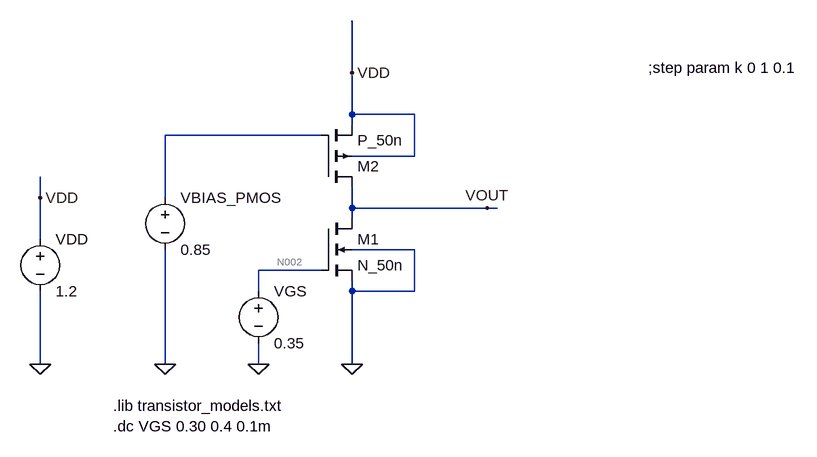
[diagram p0: schematic lab07_cs_amp_w_cs.asc]
lab07_cs_amp_w_cs.asc, the LTspice schematic file:
Version 4
SHEET 1 880 680
WIRE 160 -176 160 -256
WIRE 160 -112 160 -176
WIRE 256 -112 160 -112
WIRE 160 -96 160 -112
WIRE 112 -80 -128 -80
WIRE 256 -48 256 -112
WIRE 256 -48 160 -48
WIRE -320 16 -320 -16
WIRE -128 16 -128 -80
WIRE 160 32 160 0
WIRE 368 32 160 32
WIRE 384 32 368 32
WIRE 160 48 160 32
WIRE -320 80 -320 16
WIRE 256 96 160 96
WIRE 112 128 16 128
WIRE 16 160 16 128
WIRE 160 160 160 144
WIRE 256 160 256 96
WIRE 256 160 160 160
WIRE -320 272 -320 160
WIRE -128 272 -128 96
WIRE 16 272 16 240
WIRE 160 272 160 160
FLAG 160 272 0
FLAG 16 272 0
FLAG -320 272 0
FLAG -320 16 VDD
FLAG 368 32 VOUT
FLAG 160 -176 VDD
FLAG -128 272 0
SYMBOL nmos4 112 48 R0
SYMATTR InstName M1
SYMATTR Value2 l=2u w=62.5u
SYMATTR Value N_50n
SYMBOL voltage 16 144 R0
WINDOW 123 0 0 Left 0
WINDOW 39 0 0 Left 0
SYMATTR InstName VGS
SYMATTR Value 0.35
SYMBOL voltage -320 64 R0
WINDOW 123 0 0 Left 0
WINDOW 39 0 0 Left 0
SYMATTR InstName VDD
SYMATTR Value 1.2
SYMBOL pmos4 112 0 M180
SYMATTR InstName M2
SYMATTR Value2 l=2u w=203.4u
SYMATTR Value P_50n
SYMBOL voltage -128 0 R0
WINDOW 123 0 0 Left 0
WINDOW 39 0 0 Left 0
SYMATTR InstName VBIAS_PMOS
SYMATTR Value 0.85
TEXT -208 336 Left 2 !.lib transistor_models.txt
TEXT -208 368 Left 2 !.dc VGS 0.30 0.4 0.1m
TEXT 616 -184 Left 2 !;step param k 0 1 0.1

The netlist it stands for:
* lab07_cs_amp_w_cs.asc
M1 VOUT N002 0 0 N_50n l=2u w=62.5u
VGS N002 0 0.35
VDD VDD 0 1.2
M2 VOUT N001 VDD VDD P_50n l=2u w=203.4u
VBIAS_PMOS N001 0 0.85
.model NMOS NMOS
.model PMOS PMOS
.lib standard.mos
.lib transistor_models.txt
.dc VGS 0.30 0.4 0.1m
;step param k 0 1 0.1
.backanno
.end

* Results of the author's LTspice run, read from the files saved beside the schematic
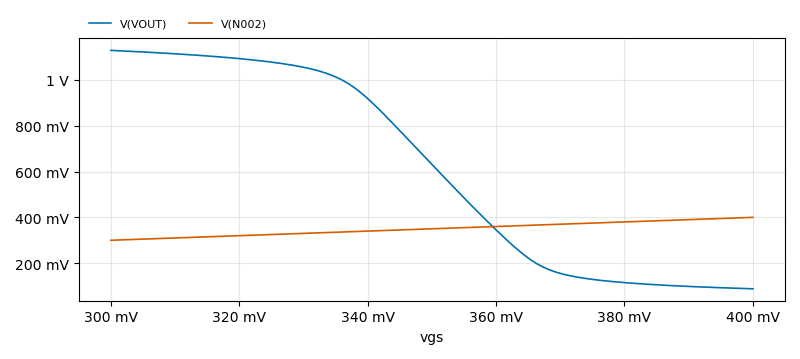
[diagram p1: DC transfer characteristic of lab07_cs_amp_w_cs.asc, plotted from the saved traces]
* DC transfer characteristic, 1 run:
*   V(VOUT): 1.129 V at vgs=300 mV, 88.1 mV at vgs=400 mV, min 88.1 mV, max 1.129 V
*   V(N002): 300 mV at vgs=300 mV, 400 mV at vgs=400 mV, min 300 mV, max 400 mV